# EAGLE design filter (EAGLE 7.5.0)
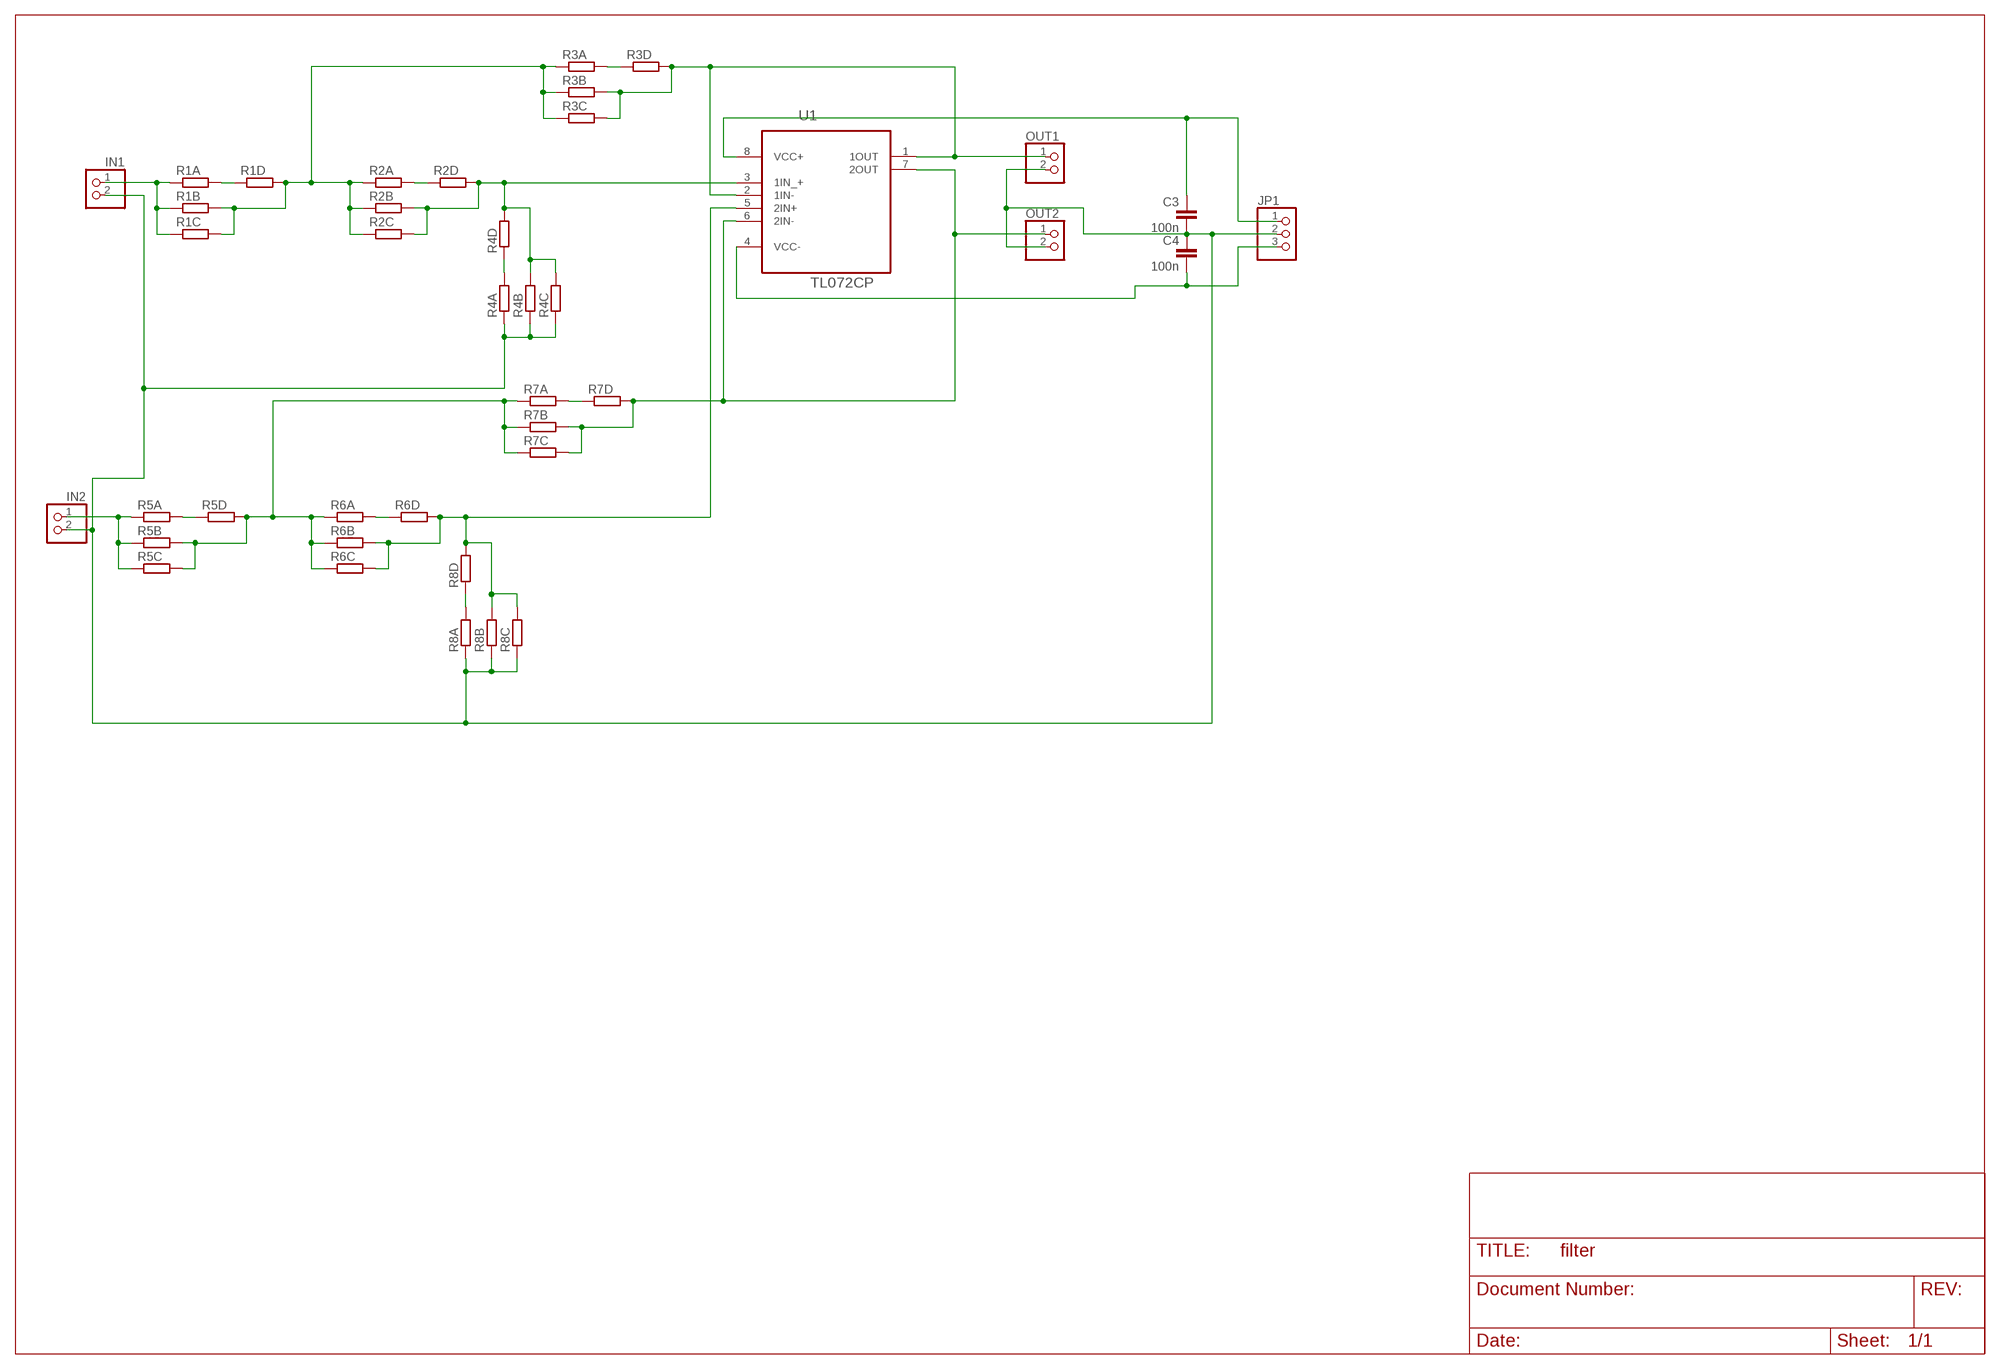
[diagram p0: schematic, sheet 1]

## Parts
C3  100n  C-EUC1206  [C1206]
C4  100n  C-EUC1206  [C1206]
IN1  PINHD-1X2  [1X02]
IN2  PINHD-1X2  [1X02]
JP1  PINHD-1X3  [1X03]
OUT1  PINHD-1X2  [1X02]
OUT2  PINHD-1X2  [1X02]
R1A  R-EU_0207/10  [0207/10]
R1B  R-EU_0207/10  [0207/10]
R1C  R-EU_0207/10  [0207/10]
R1D  R-EU_0207/10  [0207/10]
R2A  R-EU_0207/10  [0207/10]
R2B  R-EU_0207/10  [0207/10]
R2C  R-EU_0207/10  [0207/10]
R2D  R-EU_0207/10  [0207/10]
R3A  R-EU_0207/10  [0207/10]
R3B  R-EU_0207/10  [0207/10]
R3C  R-EU_0207/10  [0207/10]
R3D  R-EU_0207/10  [0207/10]
R4A  R-EU_0207/10  [0207/10]
R4B  R-EU_0207/10  [0207/10]
R4C  R-EU_0207/10  [0207/10]
R4D  R-EU_0207/10  [0207/10]
R5A  R-EU_0207/10  [0207/10]
R5B  R-EU_0207/10  [0207/10]
R5C  R-EU_0207/10  [0207/10]
R5D  R-EU_0207/10  [0207/10]
R6A  R-EU_0207/10  [0207/10]
R6B  R-EU_0207/10  [0207/10]
R6C  R-EU_0207/10  [0207/10]
R6D  R-EU_0207/10  [0207/10]
R7A  R-EU_0207/10  [0207/10]
R7B  R-EU_0207/10  [0207/10]
R7C  R-EU_0207/10  [0207/10]
R7D  R-EU_0207/10  [0207/10]
R8A  R-EU_0207/10  [0207/10]
R8B  R-EU_0207/10  [0207/10]
R8C  R-EU_0207/10  [0207/10]
R8D  R-EU_0207/10  [0207/10]
U1  TL072CP  [DIP254P762X508-8]

## Nets
N$2: IN1.1 R1A.1 R1B.1 R1C.1
N$3: R6B.2 R6C.2 R6D.2 R8B.2 R8C.2 R8D.2 U1.5(2IN+)
N$4: OUT2.1 R7B.2 R7C.2 R7D.2 U1.6(2IN-) U1.7(2OUT)
N$6: C4.2 JP1.3 U1.4(VCC-)
N$8: C3.1 JP1.1 U1.8(VCC+)
N$10: OUT1.1 R3B.2 R3C.2 R3D.2 U1.1(1OUT) U1.2(1IN-)
N$11: R1A.2 R1D.1
N$13: R2B.2 R2C.2 R2D.2 R4B.2 R4C.2 R4D.2 U1.3(1IN_+)
N$14: R2A.2 R2D.1
N$15: C3.2 C4.1 IN1.2 IN2.2 JP1.2 OUT1.2 OUT2.2 R4A.1 R4B.1 R4C.1 R8A.1 R8B.1 R8C.1
N$17: R4A.2 R4D.1
N$18: R1B.2 R1C.2 R1D.2 R2A.1 R2B.1 R2C.1 R3A.1 R3B.1 R3C.1
N$20: R3A.2 R3D.1
N$22: IN2.1 R5A.1 R5B.1 R5C.1
N$23: R5A.2 R5D.1
N$25: R6A.2 R6D.1
N$27: R8A.2 R8D.1
N$28: R5B.2 R5C.2 R5D.2 R6A.1 R6B.1 R6C.1 R7A.1 R7B.1 R7C.1
N$29: R7A.2 R7D.1

## Library data of the parts
C3 C4 = rcl:C-EU: CAPACITOR, European symbol
IN1 IN2 OUT1 OUT2 = pinhead:PINHD-1X2: PIN HEADER
JP1 = pinhead:PINHD-1X3: PIN HEADER
R1A R1B R1C R1D R2A R2B R2C R2D R3A R3B R3C R3D R4A R4B R4C R4D R5A R5B R5C R5D R6A R6B R6C R6D R7A R7B R7C R7D R8A R8B R8C R8D = rcl:R-EU_: RESISTOR, European symbol
U1 = tl072:TL072CP: OPERATIONAL AMPLIFIER; MPN: TL072CP; OC_FARNELL: 1106015; OC_NEWARK: 60K6988; PACKAGE: PDIP; SUPPLIER: Texas Instruments

## Board
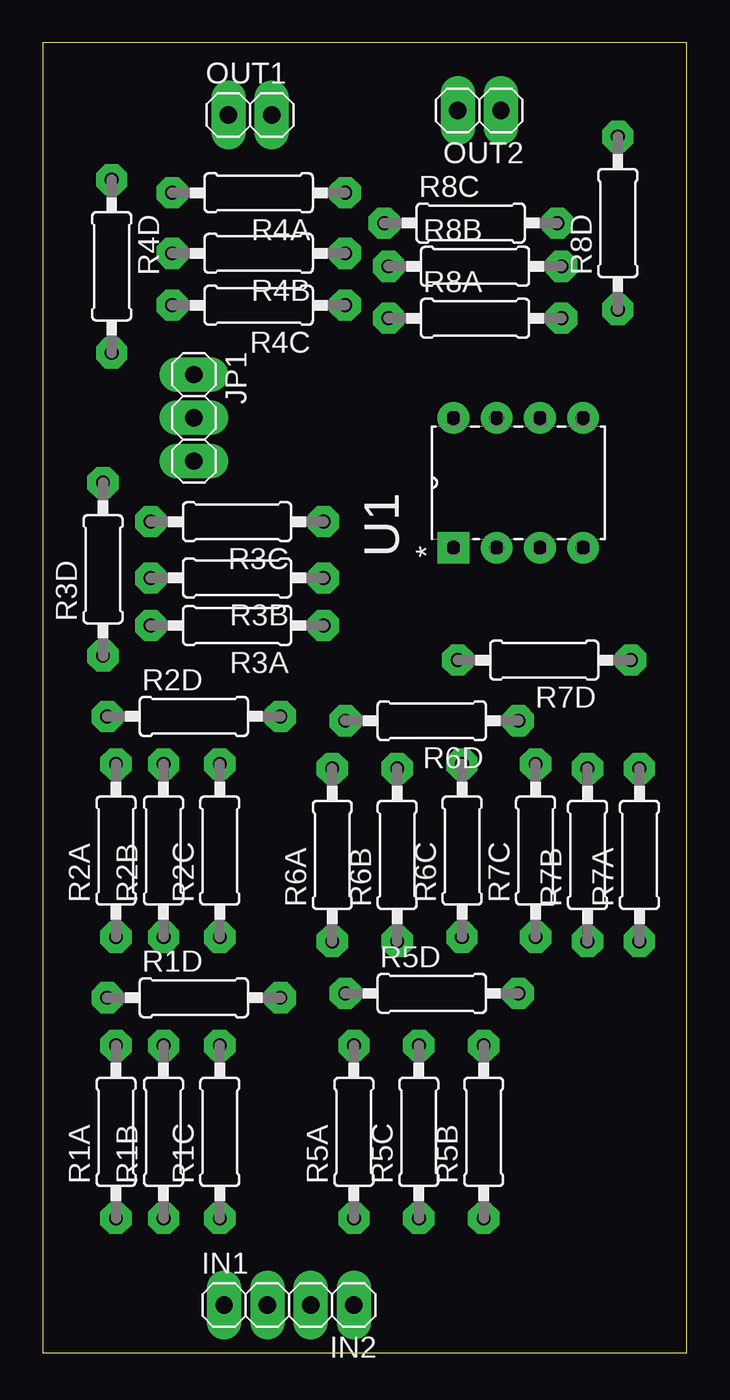
[diagram p1: board, top side]
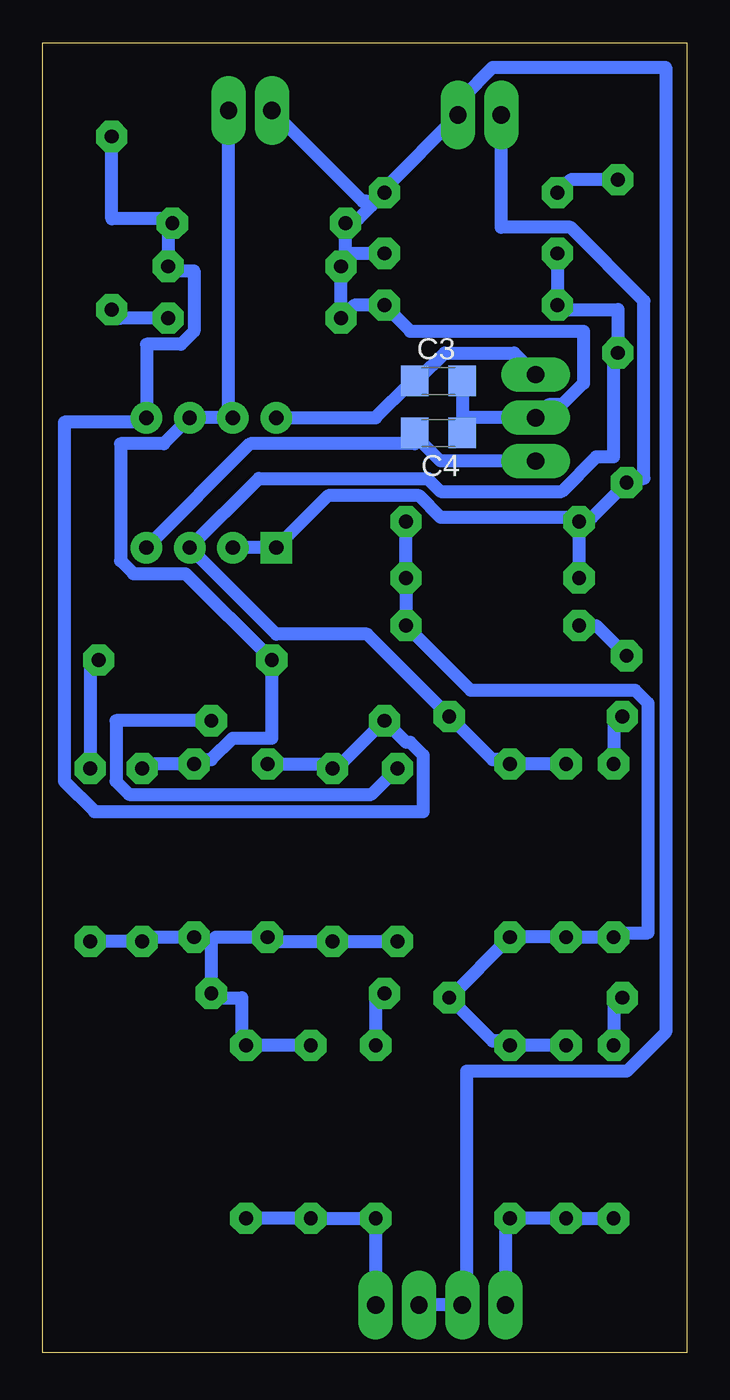
[diagram p2: board, bottom side, seen from below]

Size 37.84 x 76.89 mm. Coordinates in mm from the lower left corner, seen from the top.
Outline: 37.84,0 37.84,76.89 0,76.89 0,0 37.84,0
Copper layers (1*16): Top 0.035mm / dielectric 1.5mm / Bottom 0.035mm
Design rules "default *": minimum track width 30mil, minimum drill 24mil, track to track 8mil, track to pad 8mil, pad to pad 8mil, via to via 8mil, smd to smd 8mil, copper to edge 40mil, drill to drill 8mil, minimum pad ring 20mil, minimum via ring 8mil, stop-mask expansion 4mil, vias tented up to drill 0mil, thermal gap 10mil

### Footprints (pad centres in the part's own frame; a part is rotated, then mirrored left to right if it is on the bottom)
C1206 = smd 1.6 x 1.8: 1 -1.4,0; 2 1.4,0
1X02 = drill 1.016 long: 1 -1.27,0; 2 1.27,0
1X03 = drill 1.016 long: 1 -2.54,0; 2 0,0; 3 2.54,0
0207/10 = drill 0.813 octagon: 1 -5.08,0; 2 5.08,0
DIP254P762X508-8 = drill 0.838 square: 1 -7.62,7.62 | drill 0.838: 2 -7.62,5.08; 3 -7.62,2.54; 4 -7.62,0; 5 0,0; 6 0,2.54; 7 0,5.08; 8 0,7.62

### Placement (x,y rotation side)
C3  14.6,57.02 0 bottom
C4  14.6,53.98 180 bottom
IN1  11.93,2.79 0 top
IN2  17.01,2.79 180 top
JP1  8.88,54.86 270 top
OUT1  12.18,72.64 0 top
OUT2  25.64,72.9 180 top
R1A  4.31,12.95 90 top
R1B  7.1,12.95 90 top
R1C  10.4,12.95 90 top
R1D  8.88,20.83 0 top
R2A  4.31,29.46 90 top
R2B  7.1,29.46 90 top
R2C  10.4,29.46 90 top
R2D  8.88,37.34 0 top
R3A  11.42,42.67 180 top
R3B  11.42,45.47 180 top
R3C  11.42,48.77 180 top
R3D  3.55,45.97 90 top
R4A  12.69,68.07 180 top
R4B  12.69,64.52 180 top
R4C  12.69,61.47 180 top
R4D  4.05,63.75 270 top
R5A  18.28,12.95 90 top
R5B  25.9,12.95 90 top
R5C  22.09,12.95 90 top
R5D  22.85,21.08 0 top
R6A  17.01,29.21 90 top
R6B  20.82,29.21 90 top
R6C  24.63,29.46 90 top
R6D  22.85,37.08 180 top
R7A  35.04,29.21 90 top
R7B  31.99,29.21 90 top
R7C  28.95,29.46 90 top
R7D  29.45,40.64 180 top
R8A  25.39,60.71 0 top
R8B  25.39,63.75 0 top
R8C  25.14,66.29 0 top
R8D  33.77,66.29 90 top
U1  31.74,54.86 90 top

### Tracks (layer width: path | path; a pad name or v marks a point on that pad's centre or on a via)
N$2
  Bottom 0.762: R1A.1 R1B.1 R1C.1 10.66,7.62 IN1.1
N$3
  Bottom 0.762: R6C.2 21.07,34.54 R6B.2 20.56,34.54 20.31,34.54 R6D.2 16.5,35.81 16.25,35.81 15.48,35.05 15.48,31.75 34.79,31.75 36.57,33.53 36.57,54.61 31.99,54.61 U1.5 31.74,59.18 29.71,59.18 28.95,59.94 28.95,63.5 30.22,63.5 R8B.2 30.47,66.29 R8C.2 30.72,66.55 33.77,66.55 R8D.2
N$4
  Bottom 0.762: R7B.2 31.74,34.54 R7C.2 28.69,34.8 27.93,34.8 26.66,36.07 24.37,36.07 R7D.2 29.45,45.72 32.5,45.72 33.26,46.48 33.26,53.34 30.72,53.34 U1.6 U1.7 26.91,55.12 OUT2.1
N$6
  Bottom 0.762: JP1.3 14.47,52.32 15.99,53.85 C4.2 15.99,53.34 25.64,53.34 U1.4
N$8
  Bottom 0.762: U1.8 18.28,54.86 16.25,56.9 C3.1 15.74,57.15 14.21,58.67 10.15,58.67 JP1.1
N$10
  Bottom 0.762: U1.2 U1.1 21.07,50.29 15.74,50.29 14.47,49.02 6.59,49.02 R3C.2 | R3C.2 R3B.2 | R3C.2 6.09,49.02 5.58,49.02 R3D.2 3.29,51.31 2.53,51.31 2.53,61.72 6.85,66.04 10.91,66.04 OUT1.1
N$11
  Bottom 0.762: R1A.2 4.31,20.83 R1D.1
N$13
  Bottom 0.762: R4B.2 R4C.2 7.36,61.21 4.05,61.21 R4D.2 4.31,58.42 4.31,52.58 5.32,52.58 7.36,50.55 14.47,50.55 15.23,51.31 25.14,51.31 U1.3 24.12,42.16 18.79,42.16 R2D.2 11.42,34.8 10.66,34.8 R2C.2 R2B.2
N$14
  Bottom 0.762: R2A.2 4.31,37.34 R2D.1
N$15
  Bottom 0.762: C3.2 13.2,56.9 13.2,54.1 C4.1 12.94,54.86 JP1.2 8.12,55.63 7.36,55.63 6.09,56.9 6.09,59.94 16.25,59.94 R4C.1 19.55,61.47 R8A.1 R8B.1 | IN2.2 IN1.2 12.94,3.05 12.94,16.51 3.55,16.51 1.26,18.8 1.26,75.44 11.42,75.44 13.2,73.66 13.2,72.9 OUT1.2 17.77,68.33 R4A.1 18.53,67.31 | R8B.1 20.06,64.01 R8C.1 19.8,66.55 19.29,66.55 18.53,67.31 | R4B.1 19.8,64.52 R8B.1 | OUT2.2 19.04,67.56 18.79,67.56 18.53,67.31
N$17
  Bottom 0.762: R4A.2 6.85,68.83 R4D.1
N$18
  Bottom 0.762: R3C.1 R3B.1 R3A.1 12.69,38.86 3.04,38.86 2.28,38.1 2.28,24.64 4.05,24.64 R2A.1 R2B.1 R2C.1 R1D.2 11.42,18.29 10.66,18.29 R1C.2 R1B.2
N$20
  Bottom 0.762: R3D.1 5.32,42.67 R3A.2
N$22
  Bottom 0.762: R5B.1 R5C.1 R5A.1 IN2.1
N$23
  Bottom 0.762: R5A.2 18.28,21.08 R5D.1
N$25
  Bottom 0.762: R6A.2 18.53,32.77 32.76,32.77 33.52,33.53 33.52,37.08 R6D.1
N$27
  Bottom 0.762: R8D.1 33.26,60.71 R8A.2
N$28
  Bottom 0.762: R5C.2 R5B.2 26.15,18.29 26.15,20.83 27.68,20.83 R5D.2 27.93,24.13 | R7A.1 R7B.1 31.74,24.38 R7C.1 28.69,24.13 27.93,24.13 | 27.93,24.13 27.68,24.38 R6C.1 24.37,24.13 R6B.1 R6A.1
N$29
  Bottom 0.762: R7A.2 35.04,40.64 R7D.1